# EAGLE schematic HackAJeep3 (EAGLE 6.4)
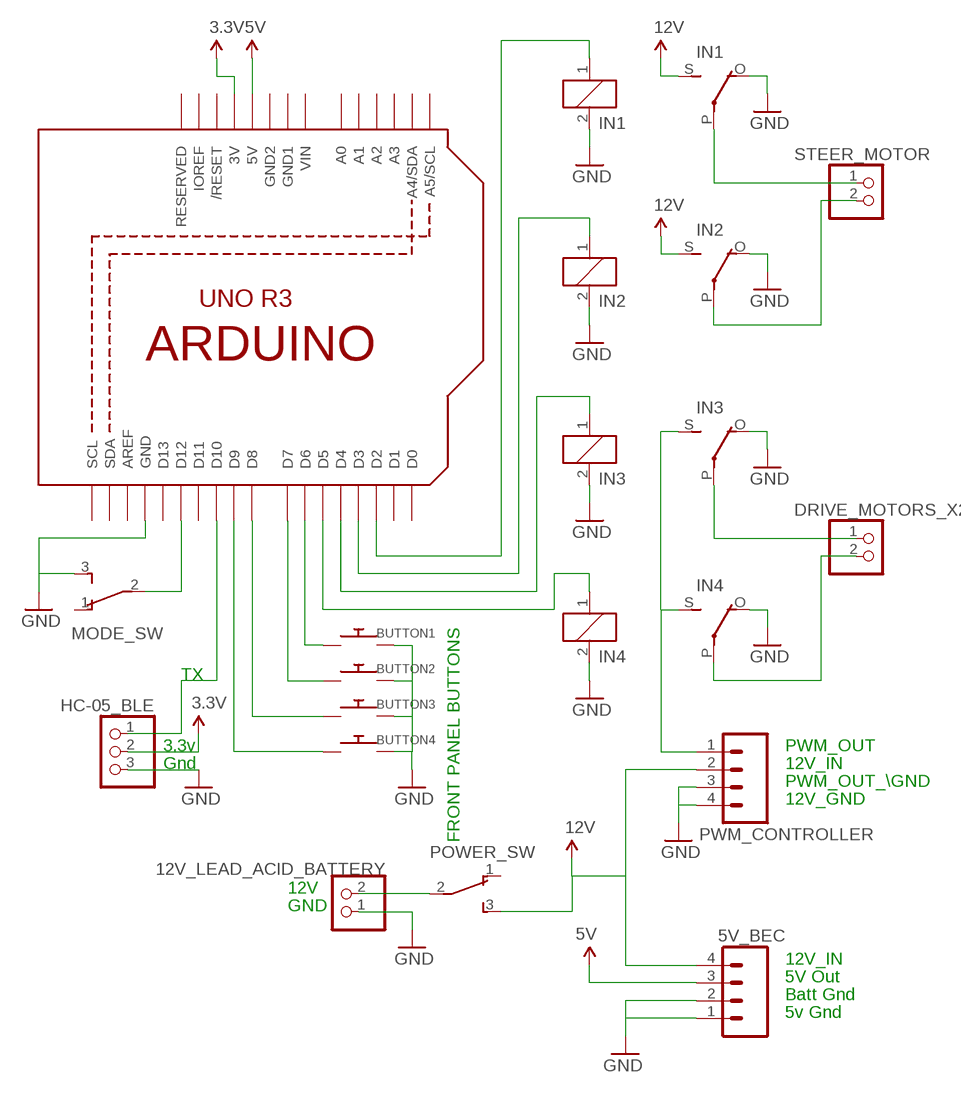
[diagram p0: schematic, sheet 1]

## Parts
5V_BEC  M04POLAR  [MOLEX-1X4]
12V_LEAD_ACID_BATTERY  PINHD-1X2  [1X02]
BUTTON1  SWITCH_PUSHBUTTONSOFTTOUCHSMD_SJ  [PUSHBUTTON_SMD_SJ]
BUTTON2  SWITCH_PUSHBUTTONSOFTTOUCHSMD_SJ  [PUSHBUTTON_SMD_SJ]
BUTTON3  SWITCH_PUSHBUTTONSOFTTOUCHSMD_SJ  [PUSHBUTTON_SMD_SJ]
BUTTON4  SWITCH_PUSHBUTTONSOFTTOUCHSMD_SJ  [PUSHBUTTON_SMD_SJ]
DRIVE_MOTORS_X2  PINHD-1X2  [1X02]
HC-05_BLE  PINHD-1X3  [1X03]
IN1  E3206L  [E3206L]
IN2  E3206L  [E3206L]
IN3  E3206L  [E3206L]
IN4  E3206L  [E3206L]
MODE_SW  TL36WO  [TL3XWO]
POWER_SW  TL36WO  [TL3XWO]
PWM_CONTROLLER  M04POLAR  [MOLEX-1X4]
STEER_MOTOR  PINHD-1X2  [1X02]
U1  ARDUINOR3-DIMENSION  [ARDUINOR3]

## Nets
3.3V: HC-05_BLE.2 U1.3V
5V: 5V_BEC.3 U1.5V
12V: 5V_BEC.4 IN1.S(2:S) IN2.S(2:S) POWER_SW.3(S) PWM_CONTROLLER.2
GND: 5V_BEC.1 5V_BEC.2 12V_LEAD_ACID_BATTERY.1 BUTTON1.P$2 BUTTON2.P$2 BUTTON3.P$2 BUTTON4.P$2 HC-05_BLE.3 IN1.2 IN1.O(2:O) IN2.2 IN2.O(2:O) IN3.2 IN3.O(2:O) IN4.2 IN4.O(2:O) MODE_SW.3(S) PWM_CONTROLLER.3 PWM_CONTROLLER.4 U1.GND
N$2: IN2.P(2:P) STEER_MOTOR.2
N$3: DRIVE_MOTORS_X2.1 IN3.P(2:P)
N$4: DRIVE_MOTORS_X2.2 IN4.P(2:P)
N$5: IN3.S(2:S) IN4.S(2:S) PWM_CONTROLLER.1
N$6: IN1.1 U1.D2
N$7: IN2.1 U1.D3
N$8: IN3.1 U1.D4
N$9: IN4.1 U1.D5
N$10: BUTTON1.P$1 U1.D6
N$11: BUTTON2.P$1 U1.D7
N$12: BUTTON3.P$1 U1.D8
N$13: BUTTON4.P$1 U1.D9
N$14: HC-05_BLE.1 U1.D10
N$15: MODE_SW.2(P) U1.D12
N$16: 12V_LEAD_ACID_BATTERY.2 POWER_SW.2(P)
STEER_MOTOR: IN1.P(2:P) STEER_MOTOR.1
Unconnected: MODE_SW.1(O) POWER_SW.1(O) U1.A0 U1.A1 U1.A2 U1.A3 U1.A4(A4/SDA) U1.A5(A5/SCL) U1.AREF U1.D0 U1.D1 U1.D11 U1.D13 U1.IOREF U1.RESERVED U1.RESET(/RESET) U1.SCL U1.SDA

## Notes on the sheet
- FRONT PANEL BUTTONS
- TX
- 3.3v | PWM_OUT
- Gnd | 12V_IN
- PWM_OUT_\GND
- 12V_GND
- 12V
- GND
- 12V_IN
- 5V Out
- Batt Gnd
- 5v Gnd

## Power pins joined to a net without a drawn wire
GND1: U1.GND1
GND2: U1.GND2
VIN: U1.VIN

## Library data of the parts
5V_BEC PWM_CONTROLLER = SparkFun-Connectors:M04: Header 4 Standard 4-pin 0.1" header. Use with straight break away headers (SKU : PRT-00116), right angle break away headers (PRT-00553), swiss pins (PRT-00743), machine pins (PRT-00117), and female headers (PRT-00115). Molex polarized connector foot print use with SKU : PRT-08231 with associated crimp pins and housings. 1MM SMD Version SKU: PRT-10208
12V_LEAD_ACID_BATTERY DRIVE_MOTORS_X2 STEER_MOTOR = pinhead:PINHD-1X2: PIN HEADER
BUTTON1-BUTTON4 = adafruit:SWITCH_PUSHBUTTON: Buttons SOFTTOUCHSMD_SJ - Soft touch temporary push button (Super Junk Akihabara) Compatible with SKPMANE010 [Mouser: 688-SKPMAN] C&K_KSS = Digikey: KSS221GLFS
HC-05_BLE = adafruit:PINHD-1X3: PIN HEADER
IN1-IN4 = relay:E3206L: RELAY 1 x switch, Eichhoff/distributor Schukat; OC_FARNELL: unknown; OC_NEWARK: unknown
MODE_SW POWER_SW = switch:TL36WO: TINY SWITCH ON - ON Source: http://www2.produktinfo.conrad.com/datenblaetter/700000-724999/705152-da-01-de-Subminiaturschalter_TL_36WO.pdf
U1 = adafruit:ARDUINOR3: This is a new object for the new Arduino R3 - with extra pins that you may want to use (such as IOref, and duplicated A4/A5